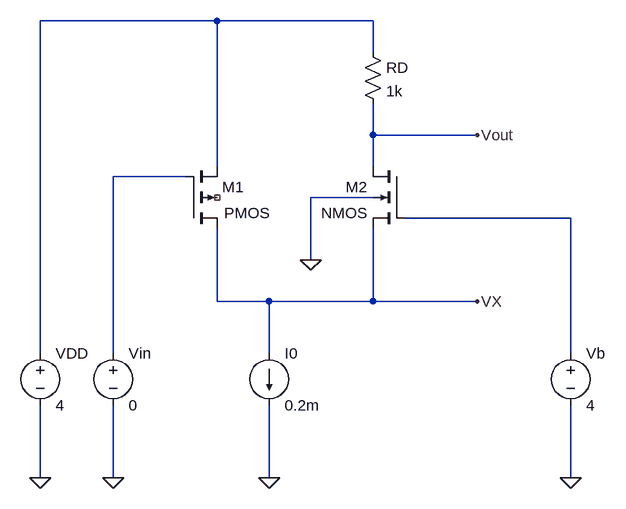
[diagram p0: schematic Chapter03D_02.fig.asc]
Chapter03D_02.fig.asc, the LTspice schematic file:
Version 4
SHEET 1 920 680
WIRE 272 -144 0 -144
WIRE 512 -144 272 -144
WIRE 512 -96 512 -144
WIRE 512 32 512 -16
WIRE 672 32 512 32
WIRE 272 80 272 -144
WIRE 512 80 512 32
WIRE 224 96 112 96
WIRE 512 128 416 128
WIRE 816 160 560 160
WIRE 416 224 416 128
WIRE 272 288 272 176
WIRE 352 288 272 288
WIRE 512 288 512 176
WIRE 512 288 352 288
WIRE 672 288 512 288
WIRE 0 368 0 -144
WIRE 112 368 112 96
WIRE 352 368 352 288
WIRE 816 368 816 160
WIRE 0 560 0 448
WIRE 112 560 112 448
WIRE 352 560 352 448
WIRE 816 560 816 448
FLAG 672 32 Vout
FLAG 672 288 VX
FLAG 0 560 0
FLAG 112 560 0
FLAG 352 560 0
FLAG 816 560 0
FLAG 416 224 0
SYMBOL pmos4 224 176 M180
WINDOW 0 56 64 Left 2
WINDOW 3 59 24 Left 2
SYMATTR InstName M1
SYMBOL nmos4 560 80 M0
SYMATTR InstName M2
SYMBOL current 352 368 R0
WINDOW 123 0 0 Left 0
WINDOW 39 0 0 Left 0
SYMATTR InstName I0
SYMATTR Value 0.2m
SYMBOL res 496 -112 R0
SYMATTR InstName RD
SYMATTR Value 1k
SYMBOL voltage 0 352 R0
WINDOW 123 0 0 Left 0
WINDOW 39 0 0 Left 0
SYMATTR InstName VDD
SYMATTR Value 4
SYMBOL voltage 112 352 R0
SYMATTR InstName Vin
SYMATTR Value 0
SYMBOL voltage 816 352 R0
SYMATTR InstName Vb
SYMATTR Value 4

The netlist it stands for:
* Chapter03D_02.fig.asc
M1 VX N002 N001 NC_01 PMOS
M2 Vout N003 VX 0 NMOS
I0 VX 0 0.2m
RD N001 Vout 1k
VDD N001 0 4
Vin N002 0 0
Vb N003 0 4
.model NMOS NMOS
.model PMOS PMOS
.lib standard.mos
.backanno
.end